# Altium schematic sheet MCU.SchDoc: {Наименование}
size 420 x 297 mm; ApprovedBy: {Утвердил}; CheckedBy: {Проверил}; DrawnBy: {Разраб.}; SheetNumber: 3; Scale: {Мш.}; PageSetup: Record=PageOptions|CenterHorizontal=False|CenterVertical=False|PrintScale=0.95|XCorrection=0.00|YCorrection=0.00|PrintKind=1|BorderSize=5000000|LeftOffset=0|BottomOffset=0|Orientation=1|PaperLength=1000|PaperWidth=1000|Scale=100|PaperSource=15|PrintQuality=600|MediaType=1|DitherType=10|PaperKind=A4|PrintScaleMode=1; ProcessInspection: {Т.контр.}; Mass: {М.}; NormInspection: {Н.контр.}; Letter1Column: {}; Letter2Column: {}; Letter3Column: {}; DocumentType: {Документ}; Rule: PcbType=ProtelPcb
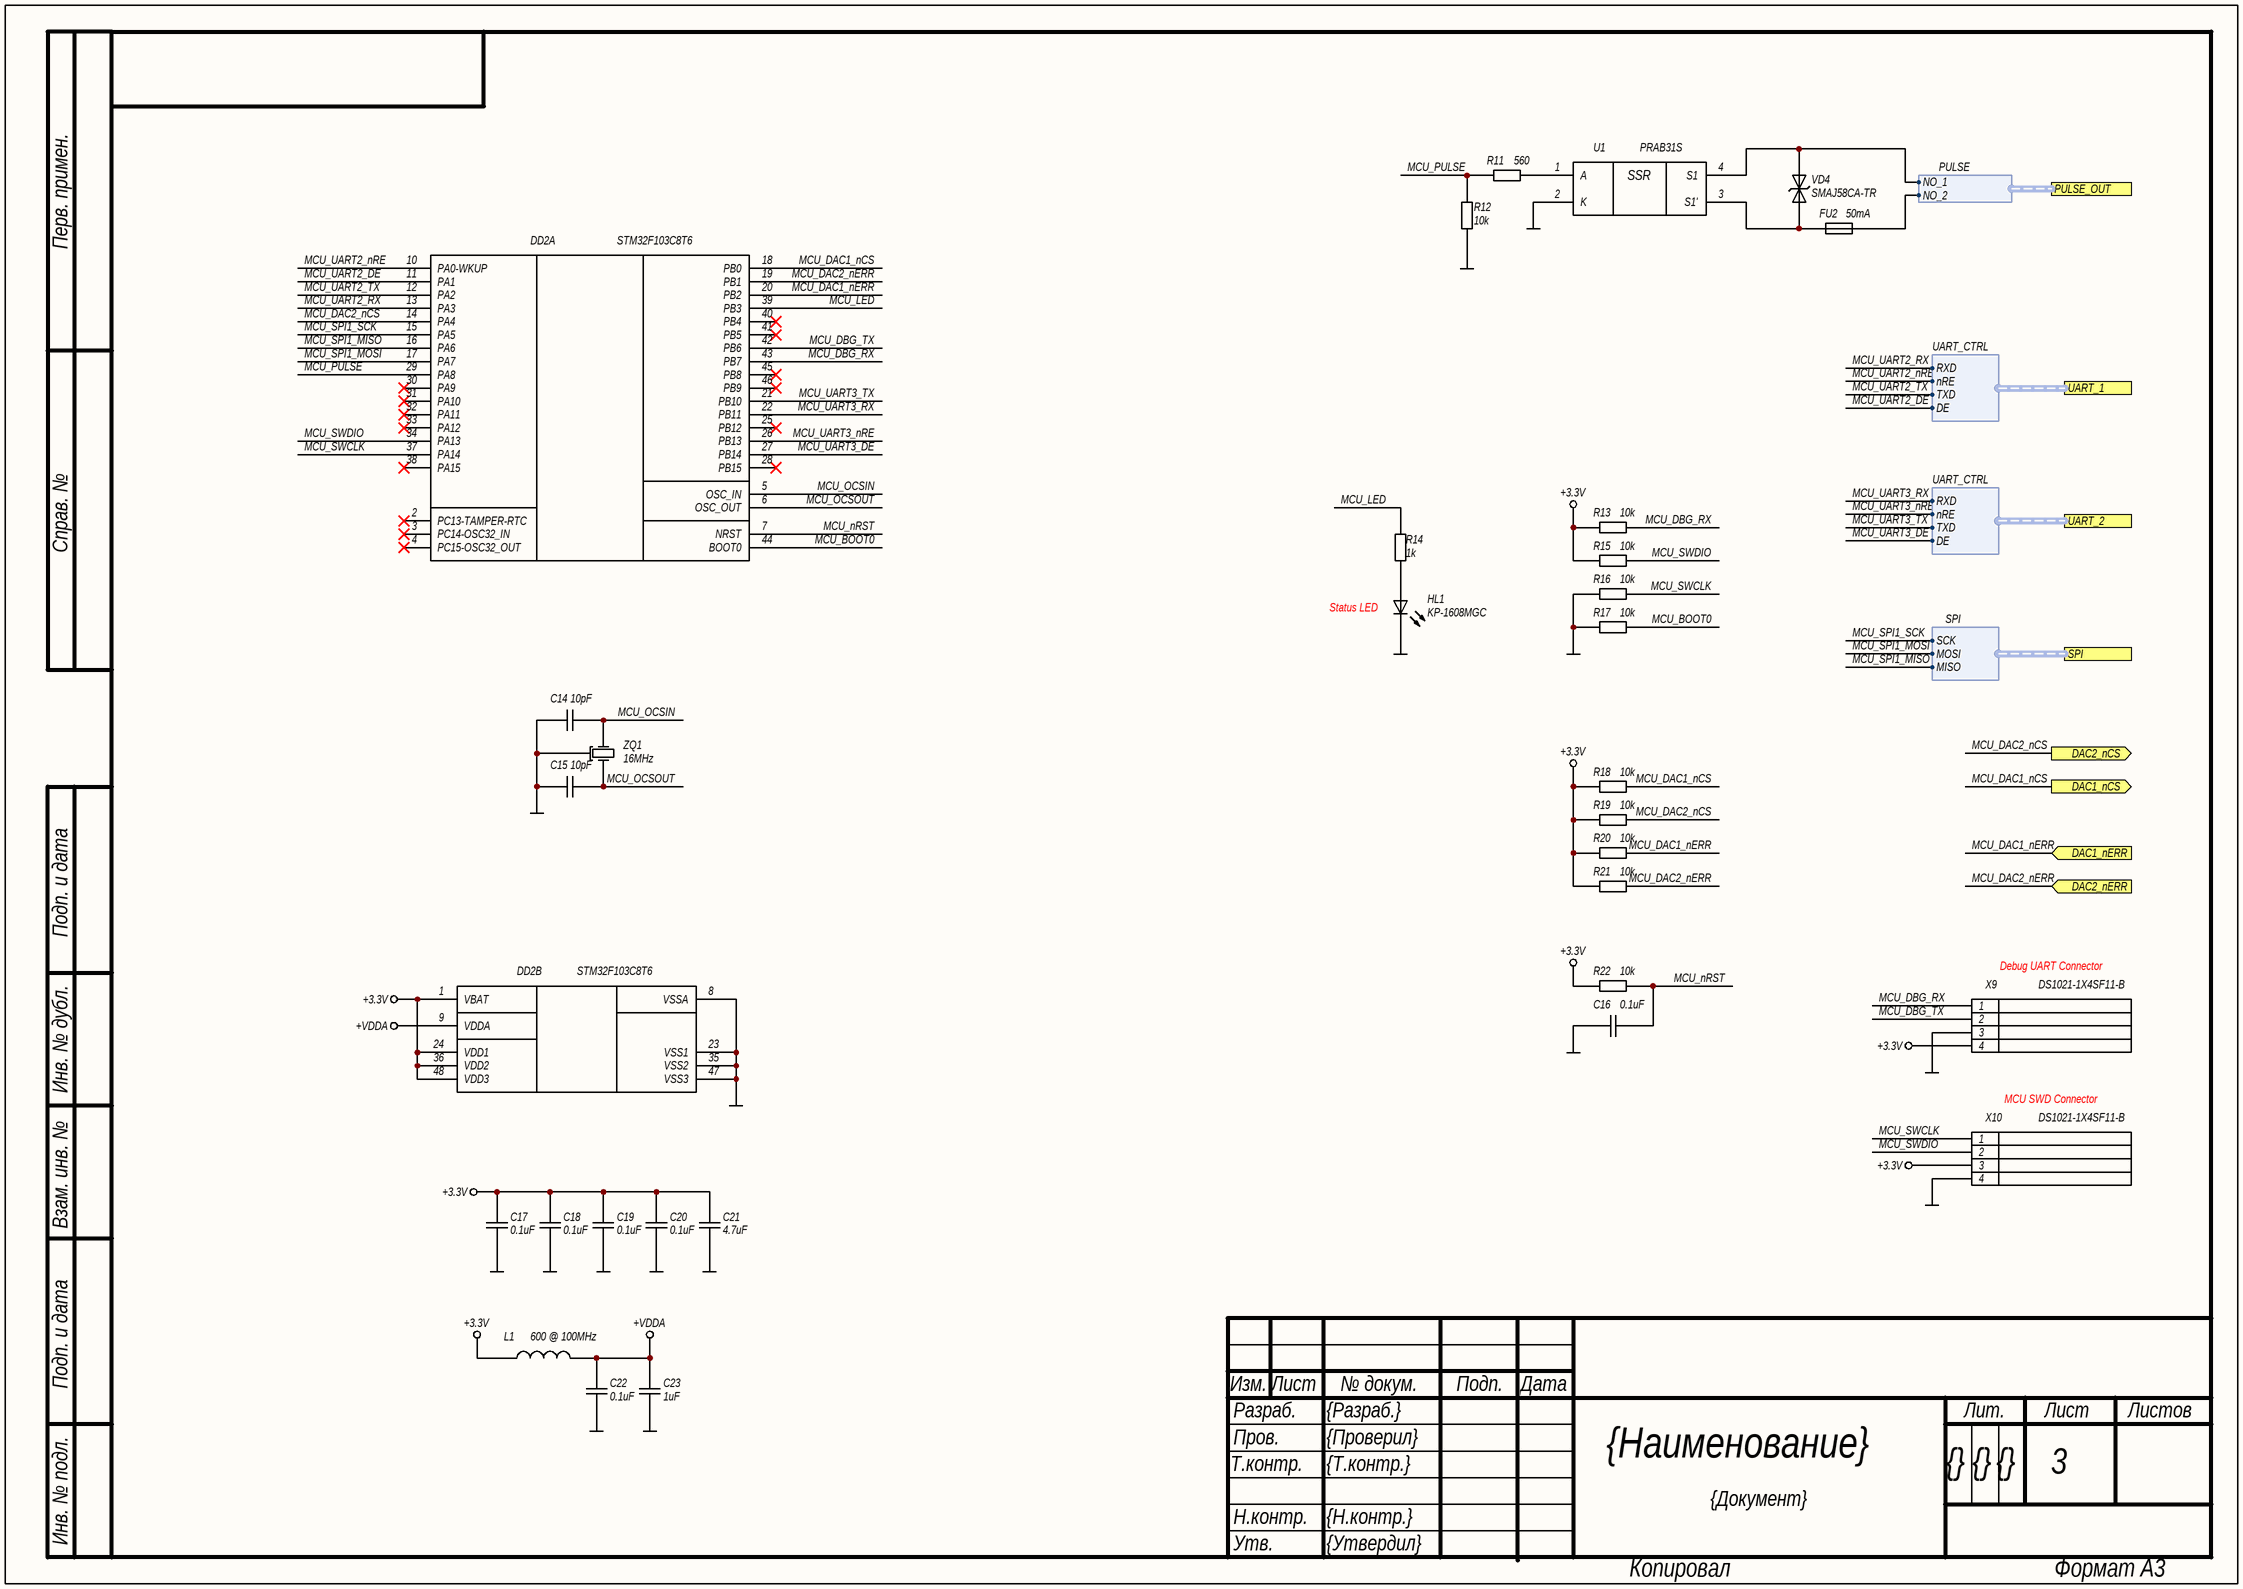
[diagram p0: MCU.SchDoc]

## Parts
C14  10pF  [C0603N]
C15  10pF  [C0603N]
C16  0.1uF  [C0603N]
C17  0.1uF  [C0603N]
C18  0.1uF  [C0603N]
C19  0.1uF  [C0603N]
C20  0.1uF  [C0603N]
C21  4.7uF  [C0805N]
C22  0.1uF  [C0603N]
C23  1uF  [C0603N]
DD2  STM32F103C8T6  [LQFP48]  (parts A,B of 2)
FU2  50mA  [0ZCJ_0.85]
HL1  KP-1608MGC  [LED0603]
L1  600 @ 100MHz  [FB0603N]
R11  560  [R0603N]
R12  10k  [R0603N]
R13  10k  [R0603N]
R14  1k  [R0603N]
R15  10k  [R0603N]
R16  10k  [R0603N]
R17  10k  [R0603N]
R18  10k  [R0603N]
R19  10k  [R0603N]
R20  10k  [R0603N]
R21  10k  [R0603N]
R22  10k  [R0603N]
U1  PRAB31S  [SOP4]
VD4  SMAJ58CA-TR  [SMA]
X9  DS1021-1X4SF11-B  [2.54_1X4_HEADER]
X10  DS1021-1X4SF11-B  [2.54_1X4_HEADER]
ZQ1  16MHz  [NX3225GA]

## Ports
DAC1_nCS (out), DAC1_nERR (in), DAC2_nCS (out), DAC2_nERR (in), PULSE_OUT (harness PULSE), SPI (harness SPI), UART_1 (harness UART_CTRL), UART_2 (harness UART_CTRL)

## Harnesses
SPI: MISO, MOSI, SCK
UART_CTRL: RXD, nRE, TXD, DE
PULSE: NO_1, NO_2

## Nets
+3.3V: C17.2 C18.2 C19.2 C20.2 C21.2 DD2.1(VBAT) DD2.24(VDD1) DD2.36(VDD2) DD2.48(VDD3) L1.1 R13.2 R15.2 R18.2 R19.2 R20.2 R21.2 R22.2 X9.4 X10.3
+VDDA: C22.2 C23.1 DD2.9(VDDA) L1.2
GND: C14.2 C15.2 C16.2 C17.1 C18.1 C19.1 C20.1 C21.1 C22.1 C23.2 DD2.8(VSSA) DD2.23(VSS1) DD2.35(VSS2) DD2.47(VSS3) HL1.1(K) R12.2 R16.2 R17.2 U1.2(K) X9.3 X10.4 ZQ1.2
MCU_BOOT0: DD2.44(BOOT0) R17.1
MCU_DAC1_nCS: DD2.18(PB0) R18.1 ; port DAC1_nCS
MCU_DAC1_nERR: DD2.20(PB2) R20.1 ; port DAC1_nERR
MCU_DAC2_nCS: DD2.14(PA4) R19.1 ; port DAC2_nCS
MCU_DAC2_nERR: DD2.19(PB1) R21.1 ; port DAC2_nERR
MCU_DBG_RX: DD2.43(PB7) R13.1 X9.1
MCU_DBG_TX: DD2.42(PB6) X9.2
MCU_LED: DD2.39(PB3) R14.1
MCU_nRST: C16.1 DD2.7(NRST) R22.1
MCU_OCSIN: C14.1 DD2.5(OSC_IN) ZQ1.3
MCU_OCSOUT: C15.1 DD2.6(OSC_OUT) ZQ1.1
MCU_PULSE: DD2.29(PA8) R11.2 R12.1
MCU_SPI1_MISO: DD2.16(PA6) ; port SPI.MISO
MCU_SPI1_MOSI: DD2.17(PA7) ; port SPI.MOSI
MCU_SPI1_SCK: DD2.15(PA5) ; port SPI.SCK
MCU_SWCLK: DD2.37(PA14) R16.1 X10.1
MCU_SWDIO: DD2.34(PA13) R15.1 X10.2
MCU_UART2_DE: DD2.11(PA1) ; port UART_1.DE
MCU_UART2_nRE: DD2.10(PA0-WKUP) ; port UART_1.nRE
MCU_UART2_RX: DD2.13(PA3) ; port UART_1.RXD
MCU_UART2_TX: DD2.12(PA2) ; port UART_1.TXD
MCU_UART3_DE: DD2.27(PB14) ; port UART_2.DE
MCU_UART3_nRE: DD2.26(PB13) ; port UART_2.nRE
MCU_UART3_RX: DD2.22(PB11) ; port UART_2.RXD
MCU_UART3_TX: DD2.21(PB10) ; port UART_2.TXD
NetFU2_1: FU2.1 ; port PULSE_OUT.NO_2
NetFU2_2: FU2.2 U1.3(S1') VD4.2(A2)
NetHL1_2: HL1.2(A) R14.2
NetR11_1: R11.1 U1.1(A)
NetU1_4: U1.4(S1) VD4.1(A1) ; port PULSE_OUT.NO_1

Not connected (* = marked no-connect by the designer): DD2 2(PC13-TAMPER-RTC)* 3(PC14-OSC32_IN)* 4(PC15-OSC32_OUT)* 25(PB12)* 28(PB15)* 30(PA9)* 31(PA10)* 32(PA11)* 33(PA12)* 38(PA15)* 40(PB4)* 41(PB5)* 45(PB8)* 46(PB9)*

## Notes on the sheet
- (near HL1) Status LED
- (near X9) Debug UART Connector
- MCU SWD Connector
- Перв. примен.
- Справ. №
- Подп. и дата
- Инв. № дубл.
- Взам. инв. №
- Изм.
- Лист
- № докум.
- Подп.
- Дата
- Т.контр.
- Пров.
- Разраб.
- Лит.
- Листов
- Инв. № подл.
- Н.контр.
- Утв.
- Копировал
- Формат А3
- (in symbol PRAB31S) SSR

## Library data of the parts
C14 C15 = CL10C100CB8NNNC: Конденсатор; Точность: ±0.25pF; Напряжение: 50V; Диэлектрик: NP0; Производитель: Samsung Electro-Mechanics; Описание: 10 pF ±0.25pF 50V Ceramic Capacitor C0G, NP0 0603 (1608 Metric); Корпус: 0603 (1608 Metric); Температурный диапазон: -55°C ~ 125°C; Вид монтажа: SMD; Артикул: CL10C100CB8NNNC; Номинал: 10pF; Строка для документации: https://www.samsungsem.com/resources/file/global/support/product_catalog/MLCC.pdf; Тип элемента: Конденсатор
C16-C20 C22 = CL10B104KB8NNNC: Конденсатор; Точность: 10%; Напряжение: 50V; Диэлектрик: X7R; Производитель: Samsung Electro-Mechanics; Описание: 0.1 µF ±10% 50V Ceramic Capacitor X7R 0603 (1608 Metric); Корпус: 0603 (1608 Metric); Температурный диапазон: -55°C ~ 125°C; Вид монтажа: SMD; Артикул: CL10B104KB8NNNC; Номинал: 0.1uF; Строка для документации: https://mm.digikey.com/Volume0/opasdata/d220001/medias/docus/609/CL10B104KB8NNNC_Spec.pdf; Тип элемента: Конденсатор
C21 = CL21A475KAQNNNG: Конденсатор; Точность: 10%; Напряжение: 25V; Диэлектрик: X5R; Производитель: Samsung Electro-Mechanics; Описание: 4.7 µF ±10% 25V Ceramic Capacitor X5R 0805 (2012 Metric); Корпус: 0805 (2012 Metric); Температурный диапазон: -55°C ~ 85°C; Вид монтажа: SMD; Артикул: CL21A475KAQNNNG; Номинал: 4.7uF; Строка для документации: https://mm.digikey.com/Volume0/opasdata/d220001/medias/docus/41/CL21A475KAQNNNG_DS.pdf; Тип элемента: Конденсатор
C23 = CC0603KRX7R9BB105: Конденсатор; Точность: 10%; Напряжение: 50V; Диэлектрик: X7R; Производитель: YAGEO; Описание: 1 µF ±10% 50V Ceramic Capacitor X7R 0603 (1608 Metric); Корпус: 0603 (1608 Metric); Температурный диапазон: -55°C ~ 125°C; Вид монтажа: SMD; Артикул: CC0603KRX7R9BB105; Номинал: 1uF; Строка для документации: https://www.yageo.com/upload/media/product/productsearch/datasheet/mlcc/UPY-GPHC_X7R_6.3V-to-250V_24.pdf; Тип элемента: Конденсатор
DD2 = STM32F103C8T6: Микросхема микроконтроллер; Производитель: STMicroelectronics; Описание: ARM® Cortex®-M3 STM32F1 Microcontroller IC 32-Bit Single-Core 72MHz 64KB (64K x 8) FLASH; Корпус: 48-LQFP (9x9); Температурный диапазон: -40°C ~ 85°C (TA); Вид монтажа: SMD; Артикул: STM32F103C8T6; Строка для документации: https://www.st.com/resource/en/datasheet/stm32f103cb.pdf; Тип элемента: Микросхема
FU2 = 0ZCJ0005FF2E: Плавкий предохранитель; Напряжение: 60V; Тип: PTC Resettable Fuse; Производитель: Bel Fuse Inc.; Описание: Polymeric PTC Resettable Fuse 60V 50 mA Ih Surface Mount 1206 (3216 Metric), Concave; Корпус: 1206 (3216 Metric), Concave; Температурный диапазон: -40°C ~ 85°C; Вид монтажа: SMD; Артикул: 0ZCJ0005FF2E; Ток: 50mA; Строка для документации: https://www.belfuse.com/resources/datasheets/circuitprotection/ds-cp-0zcj-series.pdf; Тип элемента: Предохранитель
HL1 = KP-1608MGC: Светодиод; Прямой ток: 20mA; Напряжение: 2.5V; Яркость: 70mcd; Цвет: Зеленый; Длина волны: 570nm; Производитель: Kingbright; Описание: Green 570nm LED Indication - Discrete 2.5V 0603 (1608 Metric); Корпус: 0603 (1608 Metric); Температурный диапазон: -40°C ~ 80°C; Вид монтажа: SMD; Тип элемента: Диод светоизлучающий; Артикул: KP-1608MGC; Строка для документации: https://docs.rs-online.com/4930/0900766b8032f177.pdf
L1 = BLM18AG601SN1D: Фильтр ЭМП индуктивный; Ток: 500mA; Сопротивление: 380m; Тип: Ferrite Bead; Производитель: Murata Electronics; Описание: 600 Ohms @ 100 MHz 1 Ferrite Bead 0603 (1608 Metric) 500mA 380mOhm; Корпус: 0603 (1608 Metric); Температурный диапазон: -55°C ~ 125°C; Вид монтажа: SMD; Артикул: BLM18AG601SN1D; Номинал: 600 @ 100MHz; Строка для документации: https://www.murata.com/en-us/products/productdata/8796738650142/ENFA0003.pdf; Тип элемента: Фильтр ЭМП
R11 = RC0603FR-07560RL: Резистор; Точность: 1%; ТКС: ±100ppm/°C; Напряжение: 75V; Производитель: YAGEO; Описание: 560 Ohms ±1% 0.1W, 1/10W Chip Resistor 0603 (1608 Metric) Moisture Resistant Thick Film; Корпус: 0603 (1608 Metric); Температурный диапазон: -55°C ~ 155°C; Вид монтажа: SMD; Артикул: RC0603FR-07560RL; Номинал: 560; Строка для документации: https://www.yageo.com/upload/media/product/app/datasheet/rchip/pyu-rc_group_51_rohs_l.pdf; Тип элемента: Резистор
R12 R13 R15-R22 = RC0603FR-0710KL: Резистор; Точность: 1%; ТКС: ±100ppm/°C; Напряжение: 75V; Производитель: YAGEO; Описание: 10 kOhms ±1% 0.1W, 1/10W Chip Resistor 0603 (1608 Metric) Moisture Resistant Thick Film; Корпус: 0603 (1608 Metric); Температурный диапазон: -55°C ~ 155°C; Вид монтажа: SMD; Артикул: RC0603FR-0710KL; Номинал: 10k; Строка для документации: https://www.yageo.com/upload/media/product/app/datasheet/rchip/pyu-rc_group_51_rohs_l.pdf; Тип элемента: Резистор
R14 = RC0603FR-071KL: Резистор; Точность: 1%; ТКС: ±100ppm/°C; Напряжение: 75V; Производитель: YAGEO; Описание: 1 kOhms ±1% 0.1W, 1/10W Chip Resistor 0603 (1608 Metric) Moisture Resistant Thick Film; Корпус: 0603 (1608 Metric); Температурный диапазон: -55°C ~ 155°C; Вид монтажа: SMD; Артикул: RC0603FR-071KL; Номинал: 1k; Строка для документации: https://www.yageo.com/upload/media/product/app/datasheet/rchip/pyu-rc_group_51_rohs_l.pdf; Тип элемента: Резистор
U1 = PRAB31S: Твердотельное реле, SPST-NO; Контактная группа: SPST-NO (1 Form A); Напряжение обмотки: 1.3V; Ток коммутируемый: 120mA; Напряжение коммутируемое: 350V; Описание: Solid State SPST-NO (1 Form A) 4-SOP (0.173", 4.40mm); Тип: Solid State Relay; Производитель: АО Протон; Температурный диапазон: -55°C ~ 100°C; Вид монтажа: SMD; Артикул: PRAB31S; Строка для документации: https://optron.proton-orel.ru/upload/library/catalog/optrony-2024.pdf; Тип элемента: Твердотельное реле
VD4 = SMAJ58CA-TR: TVS диод двунаправленный; Напряжение: 58V; Напряжение ограничения: 121V; Напряжение пробоя: 64.4V; Ток: 19A; Тип: TVS Bidirectional; Производитель: STMicroelectronics; Описание: 121V Clamp 19A (8/20µs) Ipp Tvs Diode Surface Mount DO-214AC (SMA); Корпус: DO-214AC, SMA; Температурный диапазон: -55°C ~ 150°C (TJ); Вид монтажа: SMD; Тип элемента: Диод защитный; Артикул: SMAJ58CA-TR; Строка для документации: https://www.st.com/resource/en/datasheet/cd00001333.pdf
X9 X10 = DS1021-1X4SF11-B: Разъем, 4 контакта; Тип разъема: Header, Male Pin; Количество контактов: 4; Шаг контактов: 2.54mm; Ток: 3A; Напряжение: 250V; Производитель: Connfly electronic (Zhenqin); Описание: Connector Header Through Hole 4 position 0.100" (2.54mm); Температурный диапазон: -40°C ~ 105°C; Вид монтажа: Through Hole; Артикул: DS1021-1X4SF11-B; Строка для документации: http://cn.connfly.group/static/upload/file/pdf/DS1021.pdf; Тип элемента: Разъем
ZQ1 = NX3225SA-16.000M-STD-CRS-2: Кварцевый резонатор, экранированный; Точность: ±15ppm; Описание: 16 MHz ±15ppm Crystal 8pF 80 Ohms 4-SMD, No Lead; Тип: MHz Crystal; Производитель: NDK (NIHON DEMPA KOGYO CO., LTD); Температурный диапазон: -40°C ~ 85°C; Корпус: 3.20mm x 2.50mm; Вид монтажа: SMD; Артикул: NX3225SA-16.000M-STD-CRS-2; Частота: 16MHz; Строка для документации: https://www.ndk.com/images/products/catalog/c_NX3225SA_e.pdf; Тип элемента: Кварцевый резонатор